# EAGLE design Regulador_RS232 (EAGLE 9.6.2)
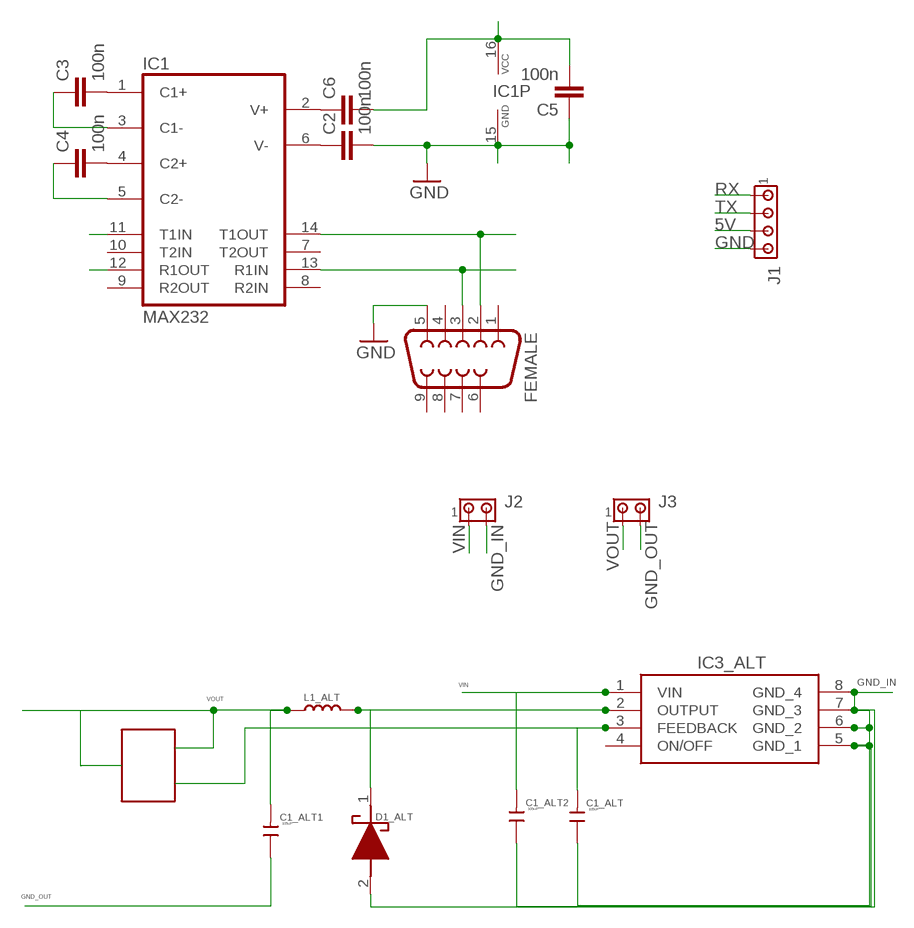
[diagram p0: schematic, sheet 1]

## Parts
C1_ALT  105uF  C-0805  [C0805]
C1_ALT1  105uF  C-0805  [C0805]
C1_ALT2  105uF  C-0805  [C0805]
C2  100n  C-EUC0805  [C0805]
C3  100n  C-EUC0805  [C0805]
C4  100n  C-EUC0805  [C0805]
C5  100n  C-EUC0805  [C0805]
C6  100n  C-EUC0805  [C0805]
D1_ALT  1N5819HW1-7-F  [SODFL3518X115N]
FEMALE  F09H  [F09H]
IC1  MAX232  MAX232ECWES  [SO16]
IC3_ALT  XL1509-3.3E1  [SOIC127P600X175-8N]
J1  MTA04-156  [1X4MTA]
J2  MTA02-156  [1X2MTA]
J3  MTA02-156  [1X2MTA]
L1_ALT  47uH  L'PIO73'  [PIO73]
U$1  TRIMPOT  [TRIMPOT]

## Nets
5V: C5.2 C6.2 IC1.16(VCC) J1.3
GND: C2.2 C5.1 FEMALE.5 IC1.15(GND) J1.4
GND_IN: C1_ALT2.1 C1_ALT.1 D1_ALT.2(A) IC3_ALT.5(GND_1) IC3_ALT.6(GND_2) IC3_ALT.7(GND_3) IC3_ALT.8(GND_4) J2.2
GND_OUT: C1_ALT1.1 J3.2
N$3: D1_ALT.1(K) IC3_ALT.2(OUTPUT) L1_ALT.1
N$8: C1_ALT.2 IC3_ALT.3(FEEDBACK) U$1.OUT
N$10: C3.2 IC1.1(C1+)
N$12: C4.2 IC1.4(C2+)
N$13: C3.1 IC1.3(C1-)
N$14: C4.1 IC1.5(C2-)
N$15: C6.1 IC1.2(V+)
N$16: C2.1 IC1.6(V-)
N$19: FEMALE.2 IC1.14(T1OUT)
N$20: FEMALE.3 IC1.13(R1IN)
RX: IC1.12(R1OUT) J1.1
TX: IC1.11(T1IN) J1.2
VIN: C1_ALT2.2 IC3_ALT.1(VIN) J2.1
VOUT: C1_ALT1.2 J3.1 L1_ALT.2 U$1.VCC1 U$1.VCC2
Unconnected: FEMALE.1 FEMALE.4 FEMALE.6 FEMALE.7 FEMALE.8 FEMALE.9 IC1.7(T2OUT) IC1.8(R2IN) IC1.9(R2OUT) IC1.10(T2IN) IC3_ALT.4(ON/OFF)

## Library data of the parts
C1_ALT C1_ALT1 C1_ALT2 = discrete:C*: Ceramic Capacitors
C2-C6 = rcl@1:C-EU: CAPACITOR, European symbol
D1_ALT = 1N5819HW1-7-F:1N5819HW1-7-F: 1N5819 Schottky Diode 40V 1A SOD123F Source: Datasheet <https://www.diodes.com/assets/Datasheets/1N5819HW1.pdf>; ARROW_PART_NUMBER: 1N5819HW1-7-F; ARROW_PRICE-STOCK: https://www.arrow.com/en/products/1n5819hw1-7-f/diodes-incorporated?region=nac; DESCRIPTION: 1N5819 Schottky Diode 40V 1A SOD123F; HEIGHT: 1.15mm; MANUFACTURER_NAME: Diodes Inc.; MANUFACTURER_PART_NUMBER: 1N5819HW1-7-F; MOUSER_PART_NUMBER: 621-1N5819HW1-7-F; MOUSER_PRICE-STOCK: https://www.mouser.co.uk/ProductDetail/Diodes-Incorporated/1N5819HW1-7-F?qs=60RJRzIpcl9ACQG7Zn63jQ%3D%3D
FEMALE = con-subd:F09: SUB-D
IC1 = maxim-6b:MAX232ECWE: RS232 TRANSEIVER
IC3_ALT = XL1509-3.3E1:XL1509-3.3E1: 40V 2A SOP-8_150mil DC-DC Converters RoHS Source: Datasheet <https://datasheet.lcsc.com/szlcsc/XLSEMI-XL1509-3-3E1_C74193.pdf>; DESCRIPTION: 40V 2A SOP-8_150mil DC-DC Converters RoHS; HEIGHT: 1.75mm; MANUFACTURER_NAME: XLSEMI; MANUFACTURER_PART_NUMBER: XL1509-3.3E1
J1 = con-amp:MTA04-156: AMP connector
J2 J3 = con-amp:MTA02-156: AMP connector
L1_ALT = discrete:L*
U$1 = TRIMPOT:TRIMPOT

## Board
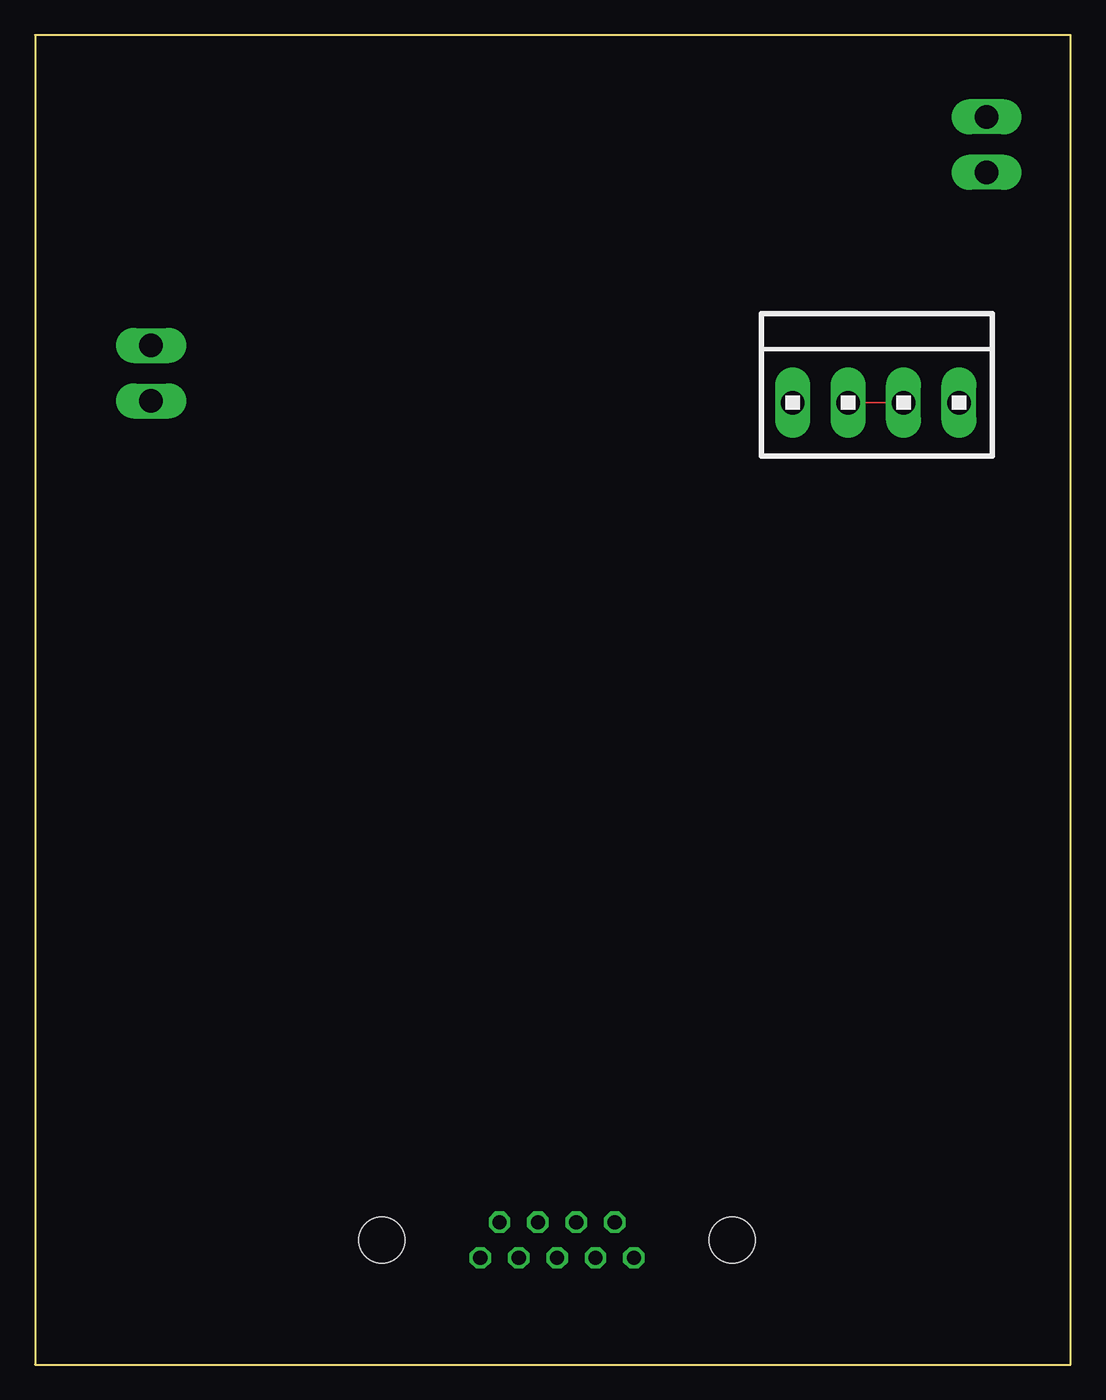
[diagram p1: board, top side]
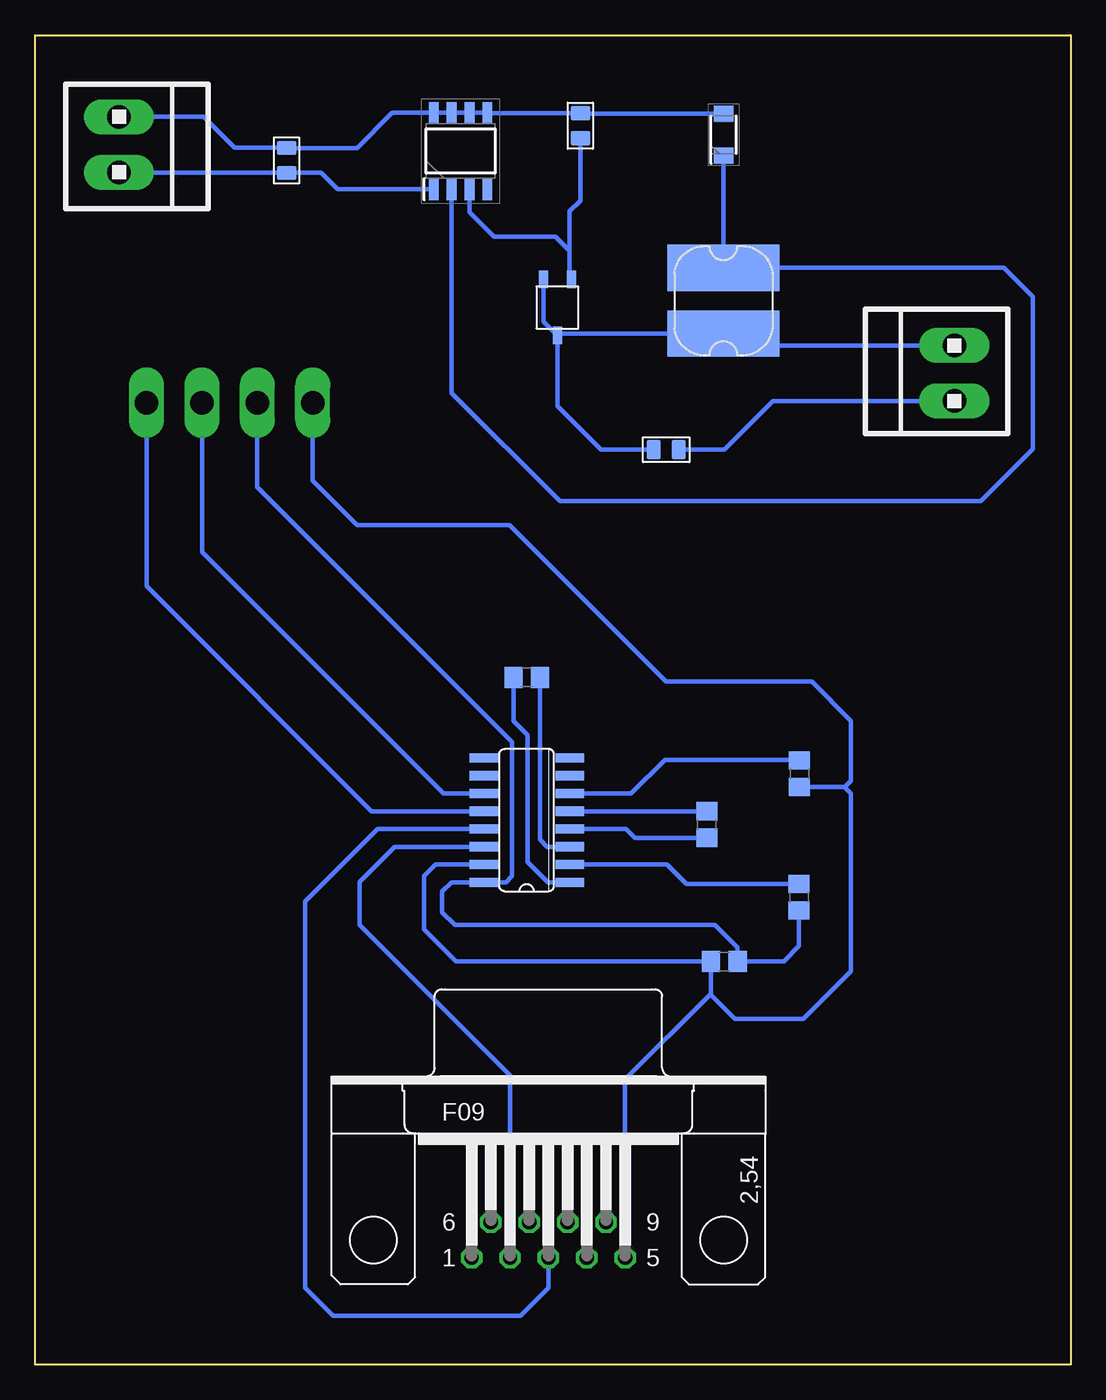
[diagram p2: board, bottom side, seen from below]

Size 74 x 95 mm. Coordinates in mm from the lower left corner, seen from the top.
Outline: 0,95 0,0 74,0 74,95 0,95
Copper layers (1*16): Top 0.035mm / dielectric 1.5mm / Bottom 0.035mm
Design rules "default": minimum track width 6mil, minimum drill 0.35mm, track to track 6mil, track to pad 6mil, pad to pad 6mil, via to via 6mil, smd to smd 6mil, copper to edge 40mil, drill to drill 6mil, minimum pad ring 10mil, minimum via ring 8mil, stop-mask expansion 4mil, vias tented up to drill 0mil, thermal gap 10mil

### Footprints (pad centres in the part's own frame; a part is rotated, then mirrored left to right if it is on the bottom)
C0805 = smd 1.016 x 1.397: 1 -0.889,0; 2 0.889,0
C0805' = smd 1.3 x 1.5: 1 -0.95,0; 2 0.95,0
SODFL3518X115N = smd 1.12 x 1.37: 1 -1.5,0; 2 1.5,0
F09H = drill 1.016 octagon: 1 -5.486,-1.27; 2 -2.743,-1.27; 3 0,-1.27; 4 2.743,-1.27; 5 5.486,-1.27; 6 -4.115,1.27; 7 -1.372,1.27; 8 1.372,1.27; 9 4.115,1.27 | hole 3.302: -12.522,0; 12.522,0
SO16 = smd 0.66 x 2.032: 1 -4.445,-3.073; 2 -3.175,-3.073; 3 -1.905,-3.073; 4 -0.635,-3.073; 5 0.635,-3.073; 6 1.905,-3.073; 7 3.175,-3.073; 8 4.445,-3.073; 9 4.445,3.073; 10 3.175,3.073; 11 1.905,3.073; 12 0.635,3.073; 13 -0.635,3.073; 14 -1.905,3.073; 15 -3.175,3.073; 16 -4.445,3.073
SOIC127P600X175-8N = smd 1.55 x 0.7: 1 -2.725,1.905; 2 -2.725,0.635; 3 -2.725,-0.635; 4 -2.725,-1.905; 5 2.725,-1.905; 6 2.725,-0.635; 7 2.725,0.635; 8 2.725,1.905
1X4MTA = drill 1.676 long: 1 5.944,0; 2 1.981,0; 3 -1.981,0; 4 -5.944,0
1X2MTA = drill 1.676 long: 1 1.981,0; 2 -1.981,0
PIO73 = smd 8 x 3.3: 1 0,2.35; 2 0,-2.35
TRIMPOT = smd 1.27 x 0.635: OUT 0.5,0.5; VCC1 -3.5,1.5; VCC2 0.5,2.5

### Placement (x,y rotation side)
C1_ALT  35.03,88.52 270 bottom
C1_ALT1  28.89,65.37 180 bottom
C1_ALT2  56.03,86.04 270 bottom
C2  100n  [C0805']  19.36,42.22 270 bottom
C3  100n  [C0805']  38.86,49.1 180 bottom
C4  100n  [C0805']  26,38.59 270 bottom
C5  100n  [C0805']  24.74,28.8 0 bottom
C6  100n  [C0805']  19.4,33.39 270 bottom
D1_ALT  24.79,87.88 90 bottom
FEMALE  37.31,8.9 0 bottom
IC1  38.87,38.9 90 bottom
IC3_ALT  43.59,86.71 90 bottom
J1  60.09,68.73 0 top
J2  67.99,87.17 270 bottom
J3  8.3,70.83 90 bottom
L1_ALT  24.81,76.01 0 bottom
U$1  35.17,77.03 90 bottom

### Tracks (layer width: path | path; a pad name or v marks a point on that pad's centre or on a via)
5V
  Top 0.152: 62.1,68.7 J1.3
  Bottom 0.152: J1.3
  Bottom 0.305: C6.2 19.4,29.9 20.5,28.8 C5.2 23.79,29.79 25.4,31.4 44,31.4 44.9,32.3 44.9,33.8 44.24,34.45 IC1.16 40.34,34.45 39.9,34.9 39.9,44.5 58.11,62.71 J1.3
GND
  Bottom 0.152: C5.1 | 16.13,41.27 16.17,41.27
  Bottom 0.305: IC1.15 45.38,35.73 46.2,34.9 46.2,31.1 43.9,28.8 C5.1 | C2.2 16.17,41.27 15.7,40.8 15.7,28.1 19.1,24.7 24,24.7 25.7,26.4 25.7,26.5 | 25.7,26.5 C5.1 | 16.13,41.27 15.7,41.7 15.7,46 18.5,48.8 28.9,48.8 40.1,60 51,60 54.15,63.15 J1.4 | FEMALE.5 31.82,20.38 25.7,26.5
GND_IN
  Bottom 0.152: C1_ALT.1 35.4,89.41 35.37,89.38 | 41.66,89.41 IC3_ALT.5 | 56,86.9 C1_ALT2.1
  Bottom 0.305: 35.4,89.41 41.66,89.41 | 56,86.9 51,86.9 48.47,89.44 IC3_ALT.8 IC3_ALT.7 IC3_ALT.6 IC3_ALT.5 | C1_ALT2.1 59.73,86.93 61.95,89.15 J2.2 | D1_ALT.2 35.37,89.38
GND_OUT
  Bottom 0.305: C1_ALT1.1 24.73,65.37 21.25,68.85 J3.2
N$3
  Bottom 0.152: 24.81,86.36 D1_ALT.1
  Bottom 0.305: 24.81,86.36 L1_ALT.1 4.76,78.36 2.7,76.3 2.7,65.4 6.4,61.7 36.5,61.7 44.23,69.42 IC3_ALT.2
N$8
  Bottom 0.152: 35.8,77.66 U$1.OUT
  Bottom 0.305: C1_ALT.2 35.03,83.17 35.8,82.4 35.8,79.6 | 35.8,79.6 35.8,77.66 | IC3_ALT.3 42.95,82.36 41.2,80.6 36.8,80.6 35.8,79.6
N$10
  Bottom 0.305: C3.2 39.81,46 38.81,45 38.81,35.91 37.36,34.45 IC1.1
N$12
  Bottom 0.305: C4.2 31.14,37.64 31.77,38.27 IC1.4
N$13
  Bottom 0.305: C3.1 37.91,37.51 37.39,36.99 IC1.3
N$14
  Bottom 0.152: C4.1
  Bottom 0.305: IC1.5 C4.1
N$15
  Bottom 0.305: C6.1 27.44,34.34 28.82,35.73 IC1.2
N$16
  Bottom 0.152: 19.39,43.2 C2.1
  Bottom 0.305: IC1.6 31.39,40.81 29,43.2 19.39,43.2
N$19
  Bottom 0.305: FEMALE.2 40.05,20.65 50.8,31.4 50.8,34.5 48.3,36.99 IC1.14
N$20
  Bottom 0.305: IC1.13 49.53,38.27 54.7,33.1 54.7,5.5 52.7,3.5 39.3,3.5 37.31,5.49 FEMALE.3
RX
  Bottom 0.305: IC1.12 49.94,39.53 66.03,55.63 J1.1
TX
  Bottom 0.305: 42.8,40.81 IC1.11 44.8,40.81 62.07,58.07 J1.2
VIN
  Bottom 0.152: J2.1 67.95,85.15
  Bottom 0.305: 67.95,85.15 C1_ALT2.2 53.55,85.15 52.38,83.98 IC3_ALT.1
VOUT
  Bottom 0.152: U$1.VCC1 36.72,73.58 36.64,73.66 | 23.96,72.81 L1_ALT.2
  Bottom 0.305: U$1.VCC2 37.67,74.53 36.72,73.58 | U$1.VCC1 36.67,68.47 33.57,65.37 C1_ALT1.2 | J3.1 23.96,72.81 | L1_ALT.2 36.64,73.66